# EAGLE board VCFA_v3 (EAGLE 9.4.2)
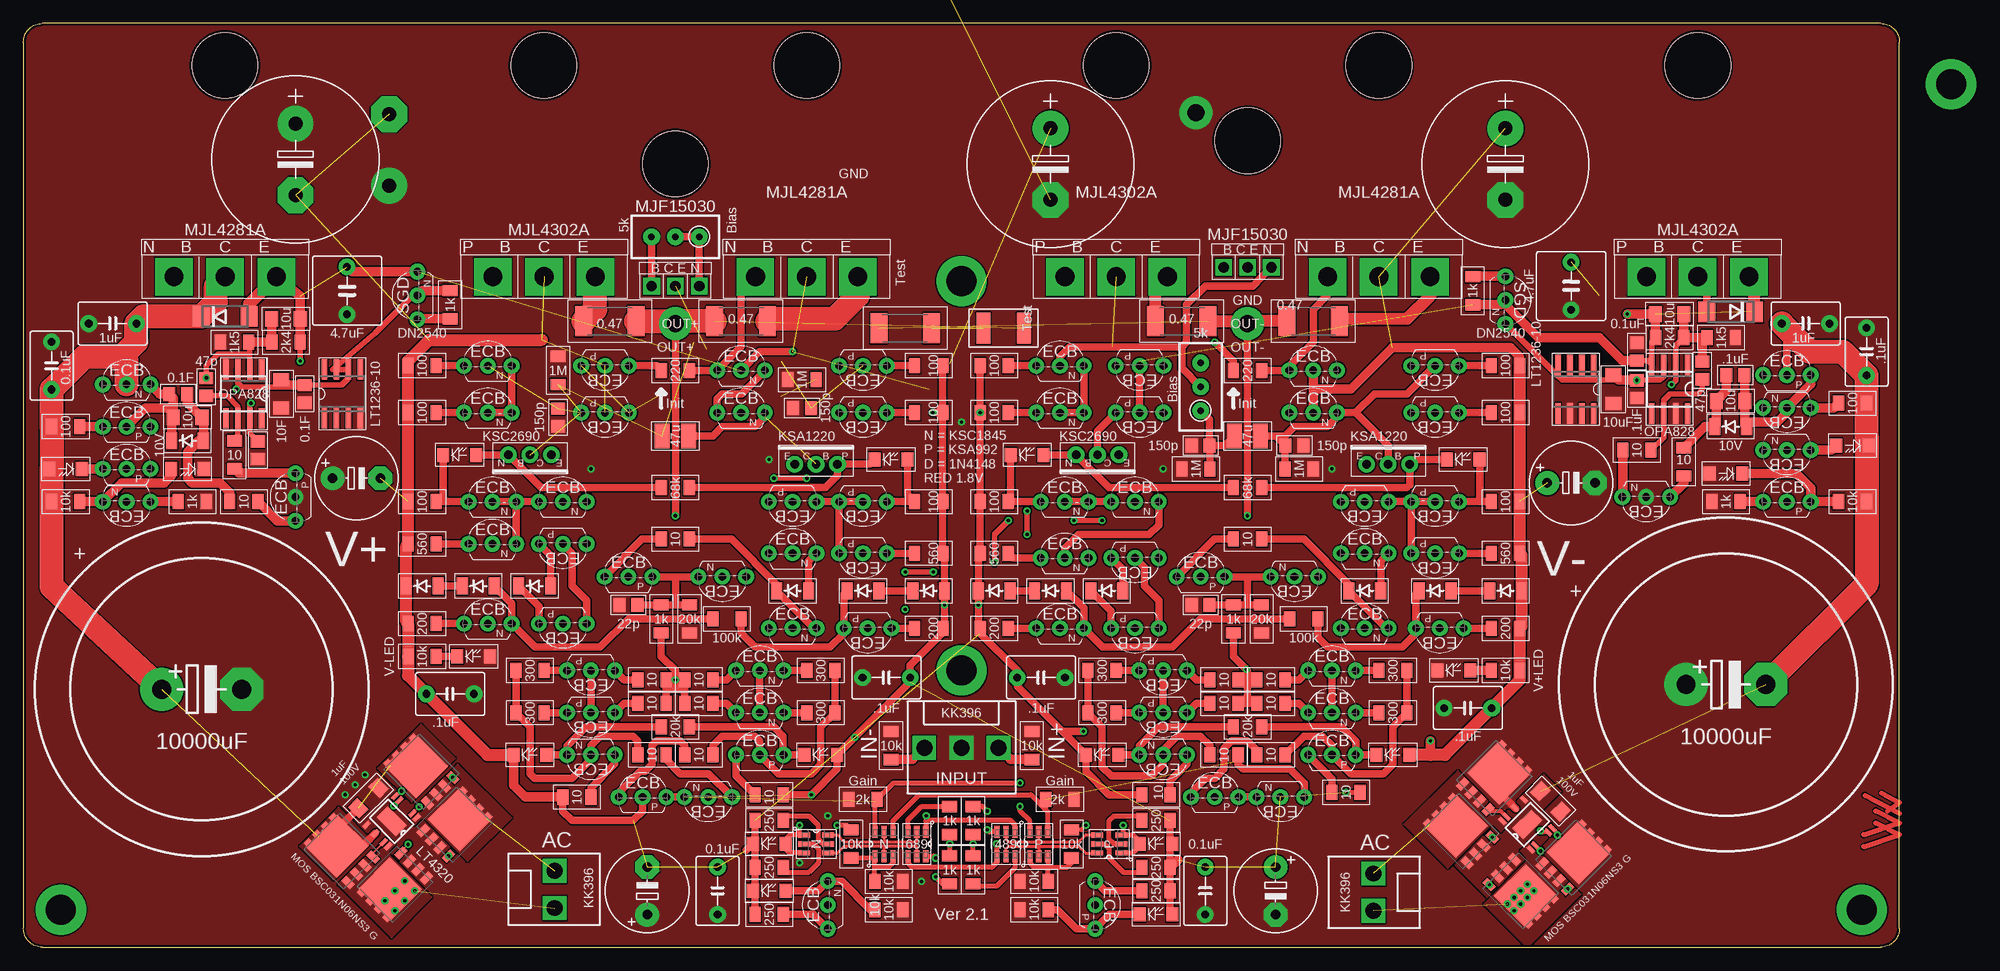
[diagram p4: board, top side]
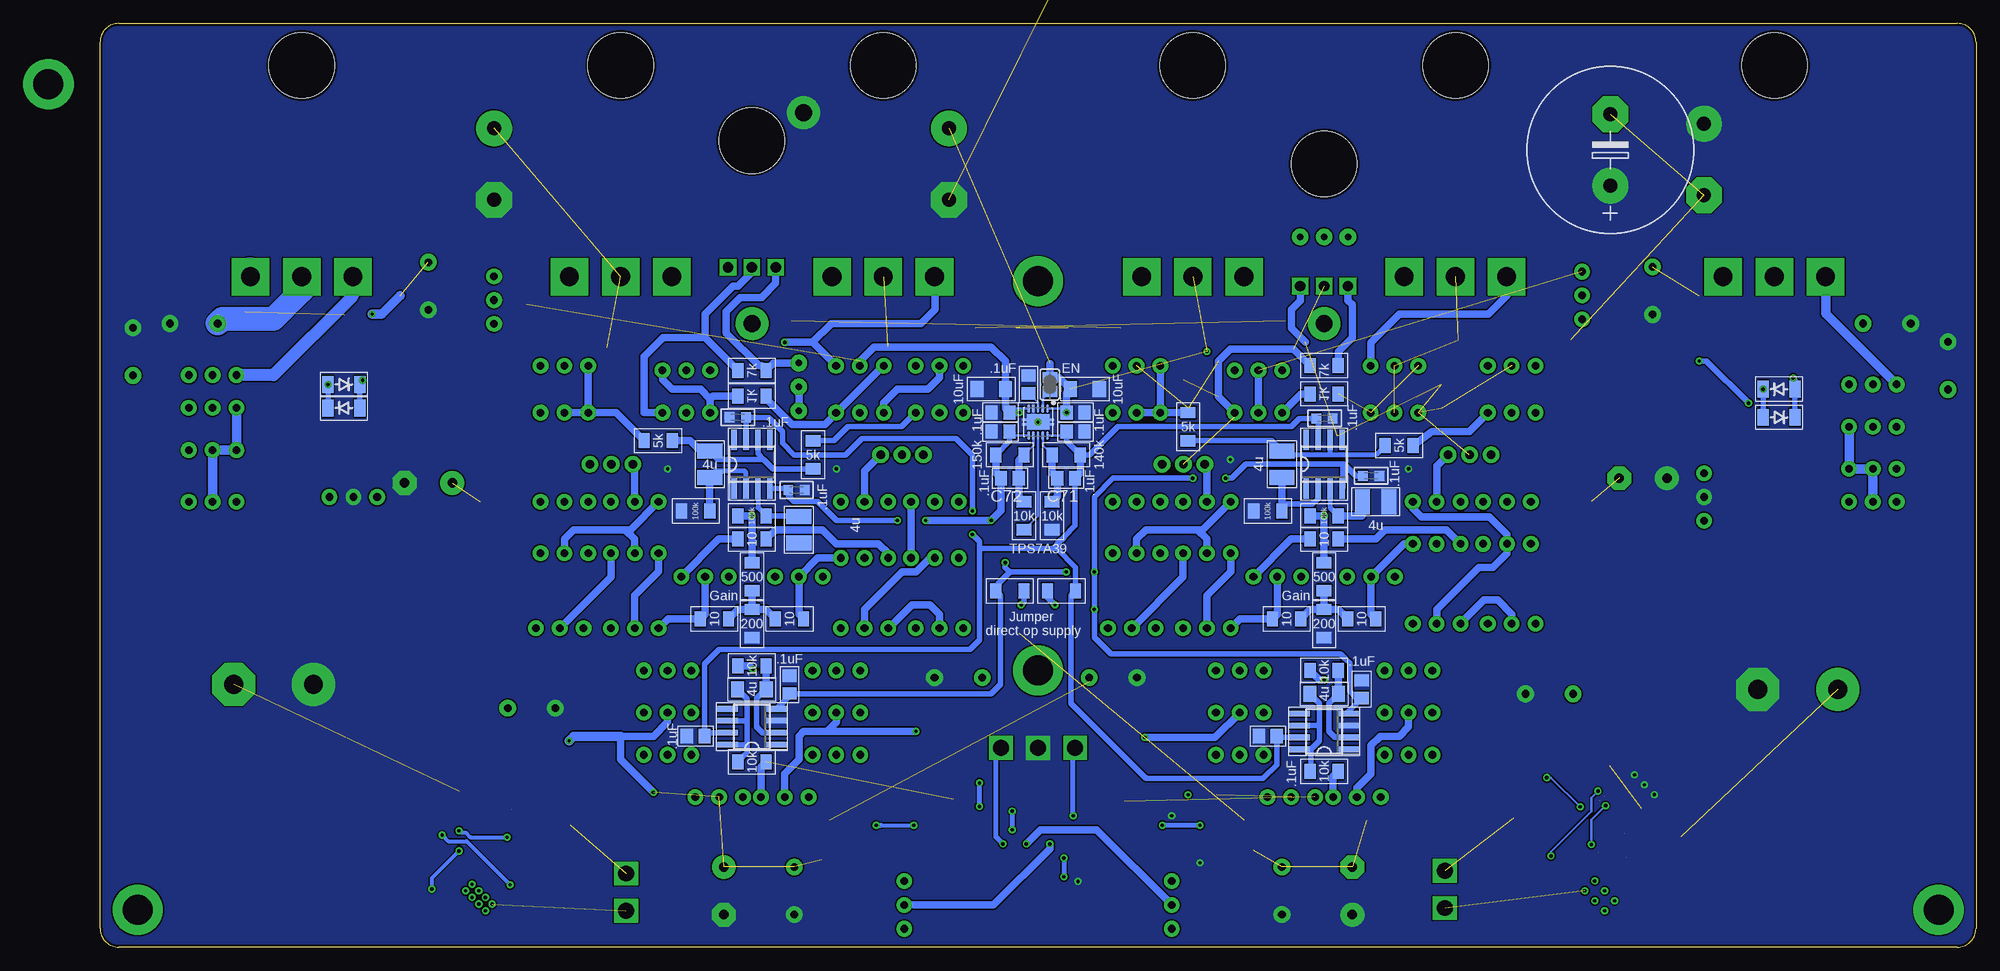
[diagram p5: board, bottom side, seen from below]

Size 200 x 98.5 mm. Coordinates in mm from the lower left corner, seen from the top.
Outline: 2,0 198,0 arc90 200,2 200,96.5 arc90 198,98.5 2,98.5 arc90 0,96.5 0,2 arc90 2,0
Copper layers (1*16): Top 0.035mm / dielectric 1.5mm / Bottom 0.035mm
Design rules "default *": minimum track width 6mil, minimum drill 0.35mm, track to track 6mil, track to pad 6mil, pad to pad 6mil, via to via 6mil, smd to smd 0mil, copper to edge 10mil, drill to drill 6mil, minimum pad ring 10mil, minimum via ring 8mil, stop-mask expansion 4mil, vias tented up to drill 0.35mm, thermal gap 3mil
Holes 7 mm at 21.5,94 55.5,94 83.5,94 69.5,83.5 116.5,94 144.5,94 130.5,86 178.5,94

## Footprints (pad centres in the part's own frame; a part is rotated, then mirrored left to right if it is on the bottom)
ECHU-Y = smd 1.5 x 3.3: 1 -2.15,0; 2 2.15,0
C0805 = smd 1.3 x 1.5: 1 -0.95,0; 2 0.95,0
E7,5-18 = drill 1.5 pad 3.81: + -3.81,0 | drill 1.5 pad 3.81 octagon: - 3.81,0
C050-045X075 = drill 0.813 pad 1.778: 1 -2.54,0; 2 2.54,0
C1206 = smd 1.4 x 1.7: 1 -1.527,0; 2 1.527,0
C1210 = smd 1.6 x 2.7: 1 -1.4,0; 2 1.4,0
C0603K = smd 1.05 x 1.08: 1 -0.875,0; 2 0.875,0
E5-8,5 = drill 1.016 pad 2.54: + -2.54,0 | drill 1.016 pad 2.54 octagon: - 2.54,0
EB35D-8.5 = drill 2.007 pad 4.597: + -4.25,0 | drill 2.007 pad 4.597 octagon: - 4.25,0
C050-075X075 = drill 0.813 pad 1.778: 1 -2.54,0; 2 2.54,0
SOD80C = smd 1.2 x 1.8: A 1.7,0; C -1.7,0
DO214AA = smd 1.8 x 2.2: A 2.55,0; C -2.55,0
SO8 = smd 0.6 x 2.2: 1 -1.905,-2.6; 2 -0.635,-2.6; 3 0.635,-2.6; 4 1.905,-2.6; 5 1.905,2.6; 6 0.635,2.6; 7 -0.635,2.6; 8 -1.905,2.6
M3_HOLE = drill 3.2 pad 5.334: P$1 0,0
SOIC8 = smd 0.6 x 2.2: 1 -1.905,-2.6; 2 -0.635,-2.6; 3 0.635,-2.6; 4 1.905,-2.6; 5 1.905,2.6; 6 0.635,2.6; 7 -0.635,2.6; 8 -1.905,2.6
LED_SML1206 = smd 1.3 x 1.5: A 1.75,0; C -1.75,0
PAD-16 = drill 1.8 pad 3.5: P$1 0,0
SOT-23-6 = smd 1.27 x 0.559: 1 -1.295,0.95; 2 -1.295,0; 3 -1.295,-0.95; 4 1.295,-0.95; 5 1.295,0; 6 1.295,0.95
TRANSISTOR_TO92-ECB_P = drill 0.813 pad 1.676: B 2.54,0; C 0,0; E -2.54,0
TRANSISTOR_TO92-ECB_N = drill 0.813 pad 1.676: B 2.54,0; C 0,0; E -2.54,0
TRANSISTOR_TO126_P = drill 0.9 pad 1.778: B 2.286,0; C 0,0; E -2.286,0
TRANSISTOR_TO126_N = drill 0.9 pad 1.778: B 2.286,0; C 0,0; E -2.286,0
TRANSISTOR_TO220_BCE_N = drill 1.1 pad 1.778 square: B -2.54,0; C 0,0; E 2.54,0
TRANSISTOR_TO247_BCE_N = drill 2 pad 4 square: B -5.461,0; C 0,0; E 5.461,0
TRANSISTOR_TO247_BCE_P = drill 2 pad 4 square: B -5.461,0; C 0,0; E 5.461,0
TRANSISTOR_TO92-SGD_N = drill 0.813 pad 1.676: D 2.54,0; G 0,0; S -2.54,0
PG-TDSON-8 = smd 1.3 x 0.75: 1 -2.825,1.905; 2 -2.825,0.635; 3 -2.825,-0.635; 4 -2.825,-1.905; 5 2.825,-1.905; 6 2.825,-0.635; 7 2.825,0.635; 8 2.825,1.905 | smd 4.7 x 4.8: TH 0.725,0
MINI_MELF-0204W = smd 1.2 x 1.6: 1 -1.5,0; 2 1.5,0
RTRIM3296W = drill 0.7 pad 1.778: 1 0,-2.54; 2 0,0; 3 0,2.54
R2512 = smd 1.8 x 3.2: 1 -2.8,0; 2 2.8,0
SJ = smd 1.168 x 1.6: 1 -0.762,0; 2 0.762,0
LT4320_MSOP = smd 0.9 x 0.42: 1 -2.163,1.625; 2 -2.163,0.975; 5 -2.163,-0.975; 6 -2.163,-1.625; 7 2.15,-1.625; 9 2.15,-0.325; 11 2.15,0.975; 12 2.15,1.625 | smd 1.65 x 2.85: EXP 0,0
SON50P300X300X80-11T165X240N = smd 0.86 x 0.27: 1 -1.435,1; 2 -1.435,0.5; 3 -1.435,0; 4 -1.435,-0.5; 5 -1.435,-1; 6 1.435,-1; 7 1.435,-0.5; 8 1.435,0; 9 1.435,0.5; 10 1.435,1 | smd 1.65 x 2.4: 11 0,0 | smd 0.25 x 0.5: 12 0.25,1.45; 13 -0.25,1.435; 14 -0.25,-1.45; 15 0.25,-1.45
KK-156-3 = drill 1.7 pad 2.54 square: 1 -3.96,0; 2 0,0; 3 3.96,0
KK-156-2 = drill 1.7 pad 2.54 square: 1 -1.98,0; 2 1.98,0

## Placement (x,y rotation side)
C1  [ECHU-Y]  104.5,66 180 top
C2  0.1uF  [C0805]  101,60 90 bottom
C3  0.1uF  [C0805]  75.5,22.5 0 bottom
C4  0.1uF  [C0805]  65.5,27.5 90 bottom
C5  1000uF  [E7,5-18]  109.5,83.5 270 top
C6  1000uF  [E7,5-18]  39,85 90 bottom
C7  1000uF  [E7,5-18]  158,83.5 270 top
C8  1000uF  [E7,5-18]  29,84 270 top
C9  0.1uF  [C050-045X075]  92,28.75 180 top
C10  0.1uF  [C050-045X075]  108.5,28.75 180 top
C11  0.1uF  [C050-045X075]  154,25.5 180 top
C12  0.1uF  [C050-045X075]  45.5,27 180 top
C13  10uF  [C1206]  69.5,27 0 bottom
C14  0.1uF  [C0805]  136.5,22.5 0 bottom
C15  0.1uF  [C0805]  126.5,28 90 bottom
C16  10uF  [C1206]  130.5,27.5 0 bottom
C17  22p  [C0805]  64.5,36.5 180 top
C18  47u  [C1210]  69.5,54.5 180 top
C19  150p  [C0805]  83,57.5 0 top
C20  150p  [C0805]  57,56.5 270 top
C21  4.7uF  [C1210]  74,51.5 270 bottom
C22  4.7uF  [C1210]  64,47.5 180 bottom
C23  0.1uF  [C0603K]  69.46,56.39 0 bottom
C24  0.1uF  [C0603K]  64.5,50.25 180 bottom
C25  100uF  [E5-8,5]  133.5,6 270 top
C26  100uF  [E5-8,5]  66.5,6 90 top
C27  22p  [C0805]  125.5,36.5 180 top
C28  47u  [C1210]  130.5,54.5 180 top
C29  150p  [C0805]  135.5,53.5 180 top
C30  150p  [C0805]  125.5,53.5 180 top
C31  4.7uF  [C1210]  135,51.5 270 bottom
C32  4.7uF  [C1210]  125.5,44.5 90 bottom
C33  0.1uF  [C0603K]  132,56.5 180 bottom
C34  0.1uF  [C0603K]  125.75,48.75 180 bottom
C35  100uF  [E5-8,5]  165,49.5 0 top
C36  100uF  [E5-8,5]  35.5,50 0 top
C37  10000uF  [EB35D-8.5]  19,27.5 0 top
C38  10000uF  [EB35D-8.5]  181.5,28 0 top
C39  0.1uF  [C050-045X075]  190,66.5 0 top
C40  10uF  [C1206]  17.5,56.5 0 top
C41  10uF  [C1206]  182,58.25 0 top
C42  0.1uF  [C050-045X075]  9.5,66.5 0 top
C43  0.1uF  [C0805]  16.5,59 0 top
C44  0.1uF  [C0805]  182.5,61 0 top
C45  0.1uF  [C0805]  25,53 90 top
C46  0.1uF  [C0805]  172,63.5 90 top
C47  10uF  [C1206]  27.5,59 270 top
C48  10uF  [C1206]  169.5,59.5 90 top
C49  0.1uF  [C0805]  30,59 270 top
C50  0.1uF  [C0805]  172,59.5 90 top
C51  47p  [C0805]  19.5,59.75 90 top
C52  47p  [C0805]  179,61.5 90 top
C53  10uF  [C1206]  28,67 180 top
C54  10uF  [C1206]  175.5,67.5 180 top
C55  4.7uF  [C050-075X075]  34.5,70 90 top
C56  4.7uF  [C050-075X075]  165,70.5 270 top
C57  47uF  [C1206]  36.77,15.9 45 top
C58  0.1uF  [C050-045X075]  3,62 270 top
C59  47uF  [C1206]  162.8,15.55 135 top
C60  0.1uF  [C050-045X075]  196.5,63.5 90 top
C65  10uF  [C1206]  105,59.5 180 bottom
C66  10uF  [C1206]  95,59.5 0 bottom
C67  0.1uF  [C0805]  104,57 180 bottom
C68  0.1uF  [C0805]  96,57 0 bottom
C69  0.1uF  [C0805]  96,55 0 bottom
C70  0.1uF  [C0805]  104,55 0 bottom
C71  0.1uF  [C0805]  97,50 180 bottom
C72  0.1uF  [C0805]  103,50 180 bottom
C74  0.1uF  [C050-045X075]  126,6 270 top
C75  0.1uF  [C050-045X075]  74,6 90 top
D1  LL4148  [SOD80C]  96.5,38 0 top
D2  LL4148  [SOD80C]  89.5,38 0 top
D3  LL4148  [SOD80C]  48.5,38.5 0 top
D4  LL4148  [SOD80C]  42.5,38.5 0 top
D5  LL4148  [SOD80C]  82,38 0 top
D6  LL4148  [SOD80C]  54.5,38.5 0 top
D7  LL4148  [SOD80C]  158,38 0 top
D8  LL4148  [SOD80C]  150.5,38 0 top
D9  LL4148  [SOD80C]  109.5,38 0 top
D10  LL4148  [SOD80C]  103.5,38 0 top
D11  LL4148  [SOD80C]  143,38 0 top
D12  LL4148  [SOD80C]  115.5,38 0 top
D13  BZT55B10  [SOD80C]  17.5,54 0 top
D14  BZT55B10  [SOD80C]  182,55.5 0 top
D15  S1G  [DO214AA]  21.5,67.25 0 top
D16  S1G  [DO214AA]  182,67.75 180 top
D17  LT1236-10  [SO8]  34,59 0 top
D18  LT1236-10  [SO8]  165.5,59.5 180 top
D19  LL4148  [SOD80C]  21,59.5 0 bottom
D20  LL4148  [SOD80C]  21,56.5 180 bottom
D21  LL4148  [SOD80C]  174,57.5 0 bottom
D22  LL4148  [SOD80C]  174,60 180 bottom
H1  HOLE  [M3_HOLE]  4,4 0 top
H2  HOLE  [M3_HOLE]  196,4 0 top
H3  HOLE  [M3_HOLE]  23.5,110 0 top  (outside the outline)
H4  HOLE  [M3_HOLE]  205.5,92 0 top  (outside the outline)
H5  HOLE  [M3_HOLE]  -16,44.5 0 top  (outside the outline)
H6  HOLE  [M3_HOLE]  100,29.5 0 top
H7  HOLE  [M3_HOLE]  228.5,29.5 0 top  (outside the outline)
H8  HOLE  [M3_HOLE]  100,71 0 top
IC1  LTC2057HV  [SOIC8]  69.5,23 90 bottom
IC2  LTC2057HV  [SOIC8]  130.5,23.5 90 bottom
IC3  LTC2057HV  [SOIC8]  69.5,51.5 0 bottom
IC4  LTC2057HV  [SOIC8]  130.5,51.5 0 bottom
IC5  OPA827  [SOIC8]  175.5,59.5 180 top
IC6  OPA827  [SOIC8]  23.5,59 180 top
LED1  RED  [LED_SML1206]  120.75,3.5 0 top
LED2  RED  [LED_SML1206]  79.5,6 0 top
LED3  RED  [LED_SML1206]  120.75,11 0 top
LED4  RED  [LED_SML1206]  79.5,11 0 top
LED5  RED  [LED_SML1206]  85,20.5 0 top
LED6  RED  [LED_SML1206]  54,20.5 0 top
LED7  RED  [LED_SML1206]  146,20.5 0 top
LED8  RED  [LED_SML1206]  115,20.5 0 top
LED9  RED  [LED_SML1206]  92.5,52 0 top
LED10  RED  [LED_SML1206]  46.5,52.5 0 top
LED11  RED  [LED_SML1206]  153.5,52 0 top
LED12  RED  [LED_SML1206]  107,52.5 0 top
LED13  RED  [LED_SML1206]  17.5,51 180 top
LED14  RED  [LED_SML1206]  181.5,50.5 180 top
LED15  RED  [LED_SML1206]  4.5,51 180 top
LED16  RED  [LED_SML1206]  195,53.5 180 top
LED17  RED  [LED_SML1206]  152.5,29.5 0 top
LED18  RED  [LED_SML1206]  48,31 0 top
PAD1  PAD  [PAD-16]  69.5,66.5 0 top
PAD2  PAD  [PAD-16]  130.5,66.5 0 top
PAD3  PAD  [PAD-16]  125,89 0 top
PAD4  PAD  [PAD-16]  94,111 0 top  (outside the outline)
Q1  LSK689  [SOT-23-6]  95.25,11 270 top
Q2  KSA992  [TRANSISTOR_TO92-ECB_P]  114.25,4.5 270 top
Q3  KSC1845  [TRANSISTOR_TO92-ECB_N]  85.75,4.5 90 top
Q4  LSK489  [SOT-23-6]  104.75,11 270 top
Q5  LS3550  [SOT-23-6]  108.25,11 90 top
Q6  LS3250  [SOT-23-6]  91.75,11 90 top
Q7  LS3250  [SOT-23-6]  84.5,11 0 top
Q8  LS3550  [SOT-23-6]  115.75,11 180 top
Q9  KSC1845  [TRANSISTOR_TO92-ECB_N]  73,16 180 top
Q10  KSA992  [TRANSISTOR_TO92-ECB_P]  66,16 0 top
Q11  KSA992  [TRANSISTOR_TO92-ECB_P]  78.5,20.5 0 top
Q12  KSC1845  [TRANSISTOR_TO92-ECB_N]  60.5,20.5 180 top
Q13  KSC1845  [TRANSISTOR_TO92-ECB_N]  78.5,29.5 0 top
Q14  KSA992  [TRANSISTOR_TO92-ECB_P]  60.5,29.5 180 top
Q15  KSC1845  [TRANSISTOR_TO92-ECB_N]  78.5,25 0 top
Q16  KSA992  [TRANSISTOR_TO92-ECB_P]  60.5,25 180 top
Q17  KSC1845  [TRANSISTOR_TO92-ECB_N]  134,16 180 top
Q18  KSA992  [TRANSISTOR_TO92-ECB_P]  127,16 0 top
Q19  KSA992  [TRANSISTOR_TO92-ECB_P]  139.5,20.5 0 top
Q20  KSC1845  [TRANSISTOR_TO92-ECB_N]  121.5,20.5 180 top
Q21  KSC1845  [TRANSISTOR_TO92-ECB_N]  139.5,29.5 0 top
Q22  KSA992  [TRANSISTOR_TO92-ECB_P]  121.5,29.5 180 top
Q23  KSC1845  [TRANSISTOR_TO92-ECB_N]  139.5,25 0 top
Q24  KSA992  [TRANSISTOR_TO92-ECB_P]  121.5,25 180 top
Q25  KSA992  [TRANSISTOR_TO92-ECB_P]  90,34 180 top
Q26  KSA992  [TRANSISTOR_TO92-ECB_P]  64.5,39.5 0 top
Q27  KSC1845  [TRANSISTOR_TO92-ECB_N]  74.5,39.5 180 top
Q28  KSC1845  [TRANSISTOR_TO92-ECB_N]  49.5,34.5 0 top
Q29  KSC1845  [TRANSISTOR_TO92-ECB_N]  82,42 0 top
Q30  KSC1845  [TRANSISTOR_TO92-ECB_N]  82,34 0 top
Q31  KSA992  [TRANSISTOR_TO92-ECB_P]  57.5,43 180 top
Q32  KSA992  [TRANSISTOR_TO92-ECB_P]  57.5,34.5 180 top
Q33  KSA992  [TRANSISTOR_TO92-ECB_P]  89.5,42 180 top
Q34  KSC1845  [TRANSISTOR_TO92-ECB_N]  50,43 0 top
Q35  KSA992  [TRANSISTOR_TO92-ECB_P]  89.5,47.5 180 top
Q36  KSA992  [TRANSISTOR_TO92-ECB_P]  82,47.5 180 top
Q37  KSC1845  [TRANSISTOR_TO92-ECB_N]  57.5,47.5 0 top
Q38  KSC1845  [TRANSISTOR_TO92-ECB_N]  50,47.5 0 top
Q39  KSA1220  [TRANSISTOR_TO126_P]  84.5,51.5 0 top
Q40  KSC2690  [TRANSISTOR_TO126_N]  54,52.5 180 top
Q41  KSA992  [TRANSISTOR_TO92-ECB_P]  89.5,57 180 top
Q42  KSC1845  [TRANSISTOR_TO92-ECB_N]  49.5,57 0 top
Q43  KSA992  [TRANSISTOR_TO92-ECB_P]  89.5,62 180 top
Q44  KSC1845  [TRANSISTOR_TO92-ECB_N]  49.5,62 0 top
Q45  MJE15030  [TRANSISTOR_TO220_BCE_N]  69.5,70.5 0 top
Q46  KSC1845  [TRANSISTOR_TO92-ECB_N]  76.5,57 0 top
Q47  KSA992  [TRANSISTOR_TO92-ECB_P]  62,57 180 top
Q48  KSC1845  [TRANSISTOR_TO92-ECB_N]  76.5,61.5 0 top
Q49  KSA992  [TRANSISTOR_TO92-ECB_P]  62,62 180 top
Q50  MJL4281A  [TRANSISTOR_TO247_BCE_N]  83.5,71.5 0 top
Q51  MJL4302A  [TRANSISTOR_TO247_BCE_P]  55.5,71.5 0 top
Q52  KSA992  [TRANSISTOR_TO92-ECB_P]  151,34 180 top
Q53  KSA992  [TRANSISTOR_TO92-ECB_P]  125.5,39.5 0 top
Q54  KSC1845  [TRANSISTOR_TO92-ECB_N]  135.5,39.5 180 top
Q55  KSC1845  [TRANSISTOR_TO92-ECB_N]  110.5,34 0 top
Q56  KSC1845  [TRANSISTOR_TO92-ECB_N]  143,42 0 top
Q57  KSC1845  [TRANSISTOR_TO92-ECB_N]  143,34 0 top
Q58  KSA992  [TRANSISTOR_TO92-ECB_P]  118.5,41.5 180 top
Q59  KSA992  [TRANSISTOR_TO92-ECB_P]  118.5,34 180 top
Q60  KSA992  [TRANSISTOR_TO92-ECB_P]  150.5,42 180 top
Q61  KSC1845  [TRANSISTOR_TO92-ECB_N]  111,41.5 0 top
Q62  KSA992  [TRANSISTOR_TO92-ECB_P]  150.5,47.5 180 top
Q63  KSA992  [TRANSISTOR_TO92-ECB_P]  143,47.5 180 top
Q64  KSC1845  [TRANSISTOR_TO92-ECB_N]  118.5,47.5 0 top
Q65  KSC1845  [TRANSISTOR_TO92-ECB_N]  111,47.5 0 top
Q66  KSA1220  [TRANSISTOR_TO126_P]  145.5,51.5 0 top
Q67  KSC2690  [TRANSISTOR_TO126_N]  114.5,52.5 180 top
Q68  KSA992  [TRANSISTOR_TO92-ECB_P]  150.5,57 180 top
Q69  KSC1845  [TRANSISTOR_TO92-ECB_N]  110.5,57 0 top
Q70  KSA992  [TRANSISTOR_TO92-ECB_P]  150.5,62 180 top
Q71  KSC1845  [TRANSISTOR_TO92-ECB_N]  110.5,62 0 top
Q72  MJE15030  [TRANSISTOR_TO220_BCE_N]  130.5,72.5 0 top
Q73  KSC1845  [TRANSISTOR_TO92-ECB_N]  137.5,57 0 top
Q74  KSA992  [TRANSISTOR_TO92-ECB_P]  119,57 180 top
Q75  KSC1845  [TRANSISTOR_TO92-ECB_N]  137.5,61.5 0 top
Q76  KSA992  [TRANSISTOR_TO92-ECB_P]  119,62 180 top
Q77  MJL4281A  [TRANSISTOR_TO247_BCE_N]  144.5,71.5 0 top
Q78  MJL4302A  [TRANSISTOR_TO247_BCE_P]  116.5,71.5 0 top
Q79  KSC1845  [TRANSISTOR_TO92-ECB_N]  11,47.5 180 top
Q80  KSA992  [TRANSISTOR_TO92-ECB_P]  188,47.5 0 top
Q81  KSA992  [TRANSISTOR_TO92-ECB_P]  11,51 0 top
Q82  KSC1845  [TRANSISTOR_TO92-ECB_N]  188,53 180 top
Q83  KSA992  [TRANSISTOR_TO92-ECB_P]  11,55.5 0 top
Q84  KSC1845  [TRANSISTOR_TO92-ECB_N]  188,57.5 180 top
Q85  KSA992  [TRANSISTOR_TO92-ECB_P]  29,48 90 top
Q86  KSC1845  [TRANSISTOR_TO92-ECB_N]  173,48 180 top
Q87  KSC1845  [TRANSISTOR_TO92-ECB_N]  11,60 0 top
Q88  KSA992  [TRANSISTOR_TO92-ECB_P]  188,61 0 top
Q89  MJL4281A  [TRANSISTOR_TO247_BCE_N]  21.5,71.5 0 top
Q90  MJL4302A  [TRANSISTOR_TO247_BCE_P]  178.5,71.5 0 top
Q91  DN2540  [TRANSISTOR_TO92-SGD_N]  42,69.5 90 top
Q92  DN2540  [TRANSISTOR_TO92-SGD_N]  158,69 270 top
Q97  MOS_SMDTDSON-8  [PG-TDSON-8]  42.42,18.73 135 top
Q98  MOS_SMDTDSON-8  [PG-TDSON-8]  33.94,10.24 135 top
Q99  MOS_SMDTDSON-8  [PG-TDSON-8]  39.6,6.71 225 top
Q100  MOS_SMDTDSON-8  [PG-TDSON-8]  45.96,13.07 45 top
Q105  MOS_SMDTDSON-8  [PG-TDSON-8]  165.27,9.54 45 top
Q106  MOS_SMDTDSON-8  [PG-TDSON-8]  156.79,18.03 45 top
Q107  MOS_SMDTDSON-8  [PG-TDSON-8]  153.25,12.37 135 top
Q108  MOS_SMDTDSON-8  [PG-TDSON-8]  159.62,6 315 top
R3  10K  [MINI_MELF-0204W]  107.75,4 0 top
R4  10K  [MINI_MELF-0204W]  92.25,4 0 top
R5  250  [MINI_MELF-0204W]  120.75,6 0 top
R6  1K  [MINI_MELF-0204W]  98.75,13.5 270 top
R7  250  [MINI_MELF-0204W]  79.5,3.5 0 top
R8  1K  [MINI_MELF-0204W]  98.75,8.25 90 top
R9  1K  [MINI_MELF-0204W]  101.25,13.5 90 top
R10  1K  [MINI_MELF-0204W]  101.25,8.25 270 top
R11  2k  [MINI_MELF-0204W]  89.5,15.75 0 top
R12  250  [MINI_MELF-0204W]  120.75,13.5 0 top
R13  250  [MINI_MELF-0204W]  79.5,13.5 0 top
R14  10K  [MINI_MELF-0204W]  111.75,11 90 top
R15  10K  [MINI_MELF-0204W]  107.75,7 0 top
R16  10K  [MINI_MELF-0204W]  92.25,7 0 top
R17  10K  [MINI_MELF-0204W]  88.25,11 270 top
R18  250  [MINI_MELF-0204W]  120.75,8.5 0 top
R19  250  [MINI_MELF-0204W]  79.5,8.5 0 top
R20  2k  [MINI_MELF-0204W]  110.5,15.75 180 top
R21  10K  [MINI_MELF-0204W]  69.5,18.75 0 bottom
R22  20K  [MINI_MELF-0204W]  69.5,23.5 0 top
R23  250  [MINI_MELF-0204W]  79.5,16.25 0 top
R24  10  [MINI_MELF-0204W]  72,20.5 180 top
R25  10  [MINI_MELF-0204W]  67,20.5 180 top
R26  250  [MINI_MELF-0204W]  59,16 0 top
R27  300  [MINI_MELF-0204W]  85,29.5 0 top
R28  300  [MINI_MELF-0204W]  54,29.5 0 top
R29  10K  [MINI_MELF-0204W]  69.5,29.5 0 bottom
R30  10  [MINI_MELF-0204W]  72,28.5 0 top
R31  10  [MINI_MELF-0204W]  67,28.5 0 top
R32  300  [MINI_MELF-0204W]  85,25 0 top
R33  300  [MINI_MELF-0204W]  54,25 0 top
R34  10  [MINI_MELF-0204W]  72,26 0 top
R35  10  [MINI_MELF-0204W]  67,26 0 top
R36  10K  [MINI_MELF-0204W]  130.5,19.75 0 bottom
R37  20K  [MINI_MELF-0204W]  130.5,23.5 0 top
R38  250  [MINI_MELF-0204W]  141,16.5 0 top
R39  10  [MINI_MELF-0204W]  133,20.5 180 top
R40  10  [MINI_MELF-0204W]  128,20.5 180 top
R41  250  [MINI_MELF-0204W]  120.75,16.25 0 top
R42  300  [MINI_MELF-0204W]  146,29.5 0 top
R43  300  [MINI_MELF-0204W]  115,29.5 0 top
R44  10K  [MINI_MELF-0204W]  130.5,30 0 bottom
R45  10  [MINI_MELF-0204W]  133,28.5 0 top
R46  10  [MINI_MELF-0204W]  128,28.5 0 top
R47  300  [MINI_MELF-0204W]  146,25 0 top
R48  300  [MINI_MELF-0204W]  115,25 0 top
R49  10  [MINI_MELF-0204W]  133,26 0 top
R50  10  [MINI_MELF-0204W]  128,26 0 top
R51  1k  [MINI_MELF-0204W]  68,35 270 top
R52  20k  [MINI_MELF-0204W]  71,35 90 top
R53  100k  [MINI_MELF-0204W]  75,35 0 top
R54  200  [MINI_MELF-0204W]  96.5,34 0 top
R55  10  [MINI_MELF-0204W]  69.5,43.5 0 top
R56  10  [MINI_MELF-0204W]  69.5,43.5 180 bottom
R57  200  [MINI_MELF-0204W]  42.5,34.5 0 top
R58  560  [MINI_MELF-0204W]  96.5,42 0 top
R59  10  [MINI_MELF-0204W]  73.5,35 180 bottom
R60  10  [MINI_MELF-0204W]  65.5,35 180 bottom
R61  560  [MINI_MELF-0204W]  42.5,43 0 top
R62  100  [MINI_MELF-0204W]  96.5,47.5 0 top
R63  200  [MINI_MELF-0204W]  69.5,34.5 90 bottom
R64  100  [MINI_MELF-0204W]  42.5,47.5 0 top
R65  68k  [MINI_MELF-0204W]  69.5,49 0 top
R66  500  [MINI_MELF-0204W]  69.5,39.5 90 bottom
R67  100  [MINI_MELF-0204W]  96.5,57 0 top
R68  5k  [MINI_MELF-0204W]  84,55.5 90 bottom
R69  5k  [MINI_MELF-0204W]  61.5,53.5 180 bottom
R70  100  [MINI_MELF-0204W]  42.5,57 0 top
R71  100  [MINI_MELF-0204W]  96.5,62 0 top
R72  100  [MINI_MELF-0204W]  42.5,62 0 top
R73  7k  [MINI_MELF-0204W]  69.5,62 180 bottom
R74  5k  [RTRIM3296W]  69.5,75.75 90 top
R75  1M  [MINI_MELF-0204W]  83,60.5 180 top
R76  1M  [MINI_MELF-0204W]  57,61.5 270 top
R77  1k  [MINI_MELF-0204W]  69.5,59 180 bottom
R78  220  [MINI_MELF-0204W]  69.5,61.5 0 top
R79  100k  [MINI_MELF-0204W]  75.5,46.5 0 bottom
R80  0.5  [R2512]  76.5,66.75 0 top
R81  0.5  [R2512]  62.5,66.75 0 top
R82  100k  [MINI_MELF-0204W]  69.5,46 0 bottom
R83  1k  [MINI_MELF-0204W]  129,35 270 top
R84  20k  [MINI_MELF-0204W]  132,35 90 top
R85  100k  [MINI_MELF-0204W]  136.5,35 0 top
R86  200  [MINI_MELF-0204W]  158,34 0 top
R87  10  [MINI_MELF-0204W]  130.5,43.5 0 top
R88  10  [MINI_MELF-0204W]  130.5,43.5 180 bottom
R89  200  [MINI_MELF-0204W]  103.5,34 0 top
R90  560  [MINI_MELF-0204W]  158,42 0 top
R91  10  [MINI_MELF-0204W]  134.5,35 180 bottom
R92  10  [MINI_MELF-0204W]  126.5,35 180 bottom
R93  560  [MINI_MELF-0204W]  103.5,42 0 top
R94  100  [MINI_MELF-0204W]  158,47.5 0 top
R95  200  [MINI_MELF-0204W]  130.5,34.5 90 bottom
R96  100  [MINI_MELF-0204W]  103.5,47.5 0 top
R97  68k  [MINI_MELF-0204W]  130.5,49 0 top
R98  500  [MINI_MELF-0204W]  130.5,39.5 90 bottom
R99  100  [MINI_MELF-0204W]  158,57 0 top
R100  5k  [MINI_MELF-0204W]  140.5,54 180 bottom
R101  5k  [MINI_MELF-0204W]  124,52.5 270 bottom
R102  100  [MINI_MELF-0204W]  103.5,57 0 top
R103  100  [MINI_MELF-0204W]  158,62 0 top
R104  100  [MINI_MELF-0204W]  103.5,62 0 top
R105  7k  [MINI_MELF-0204W]  130.5,61.5 180 bottom
R106  5k  [RTRIM3296W]  125.5,59.75 0 top
R107  1M  [MINI_MELF-0204W]  136,51 0 top
R108  1M  [MINI_MELF-0204W]  125,51 0 top
R109  1k  [MINI_MELF-0204W]  130.5,58.75 180 bottom
R110  220  [MINI_MELF-0204W]  130.5,61.5 0 top
R111  100k  [MINI_MELF-0204W]  136.5,46.5 0 bottom
R112  0.5  [R2512]  137.5,66.75 0 top
R113  0.5  [R2512]  123.5,66.75 0 top
R114  100k  [MINI_MELF-0204W]  130.5,46 0 bottom
R115  10k  [MINI_MELF-0204W]  4.5,47.5 0 top
R116  10k  [MINI_MELF-0204W]  195,47.5 0 top
R117  1k  [MINI_MELF-0204W]  18,47.5 0 top
R118  1k  [MINI_MELF-0204W]  181.5,47.5 0 top
R119  100  [MINI_MELF-0204W]  4.5,55.5 0 top
R120  10  [MINI_MELF-0204W]  23.5,47.5 0 top
R121  10  [MINI_MELF-0204W]  177,51.75 90 top
R122  100  [MINI_MELF-0204W]  195,58 0 top
R123  10  [MINI_MELF-0204W]  22.5,52.5 270 top
R124  10  [MINI_MELF-0204W]  172,53 180 top
R125  1k  [MINI_MELF-0204W]  45.5,68.5 270 top
R126  1k  [MINI_MELF-0204W]  154.5,70 90 top
R127  1.5k  [MINI_MELF-0204W]  28,64.5 0 top
R128  1.5k  [MINI_MELF-0204W]  22.5,64.5 0 top
R129  1.5k  [MINI_MELF-0204W]  181,65 0 top
R130  1.5k  [MINI_MELF-0204W]  175.5,65 0 top
R131  10k  [MINI_MELF-0204W]  158,29.5 0 top
R132  10k  [MINI_MELF-0204W]  42.5,31 0 top
R133  [R2512]  94,66 180 top
R134  10K  [MINI_MELF-0204W]  107.5,21.5 270 top
R135  10K  [MINI_MELF-0204W]  92.5,21.5 270 top
R136  10k  [MINI_MELF-0204W]  97,52.5 0 bottom
R137  10k  [MINI_MELF-0204W]  98.5,46 90 bottom
R138  10k  [MINI_MELF-0204W]  101.5,46 270 bottom
R139  10k  [MINI_MELF-0204W]  103,52.5 0 bottom
R140  10k  [MINI_MELF-0204W]  103,38 0 bottom
R141  10k  [MINI_MELF-0204W]  97.5,38 180 bottom
S1  VWV  [VWV]  200,13.25 90 top
SJ1  [SJ]  98.75,60 90 bottom
U$2  LT4320MSOP  [LT4320_MSOP]  39.24,13.42 225 top
U$4  LT4320MSOP  [LT4320_MSOP]  160.32,13.08 135 top
U$5  TPS7A39WSON10-7A39  [SON50P300X300X80-11T165X240N]  100,56 270 bottom
X1  KK-156-3  [KK-156-3]  100,21.25 0 top
X2  [KK-156-2]  143.94,5.87 270 top
X3  [KK-156-2]  56.65,6.15 90 top

## Tracks (layer width: path | path; a pad name or v marks a point on that pad's centre or on a via)
+18V  (via drill 0.35)
  Top 0.61: v107,46.5 v107,44
  Bottom 0.254: U$5.10 97.39,54.56 C69.1
  Bottom 0.61: IC4.7 C33.1 128.75,56.5 127.25,55 127.25,53.75 126,52.5 120.5,52.5 118.75,54.25 108.75,54.25 107,52.5 v107,46.5 | IC1.7 74.42,22.36 C3.2 74.55,19.45 76,18 88.5,18 96.5,26 96.5,37.5 R141.1 96,40.5 98,42.5 | C69.1 96.95,53.95 R136.2 94.5,52.5 91.5,55.5 73,55.5 72.11,56.39 C23.1 70.14,56.19 IC3.7 | v107,44 106.25,43.25 106.25,42.5 | IC2.7 135.19,22.86 C14.2 135.55,30.2 134,31.75 107.25,31.75 106.25,32.75 106.25,42.5 | 98,42.5 106.25,42.5 | 98,42.5 98,43 97.56,43.44 97.51,43.44 97.24,43.71 97.24,43.76 96.05,44.95 C71.1
  Bottom 0.813: C71.1 95.5,50.55 R136.2
-18V  (via drill 0.35)
  Top 0.61: v115,45.5 v112,45.5 | v103.5,41 103.5,44 v105,45.5 | v97,40 v94,40 | v83.5,50 v80,50
  Bottom 0.254: U$5.6 102.61,54.56 C70.2
  Bottom 0.61: IC4.4 126.78,48.9 C34.2 126.62,48.12 126,47.5 123.5,47.5 121.5,45.5 v115,45.5 | C24.2 66.12,50.25 67.38,51.5 67.5,51.5 | 67.5,51.5 77.82,51.5 79.32,50 v80,50 | IC1.4 66.9,25.15 C4.1 66.05,26.55 66.75,27.25 66.75,30.3 67.21,30.76 67.26,30.76 67.75,31.25 92.25,31.25 94,33 v94,36 v94,40 94,48 92,50 v83.5,50 | C70.2 103.05,53.95 R139.1 | IC3.4 67.5,48.99 67.5,51.5 | IC2.4 126.5,26.8 C15.1 126.45,27 105,27 104,28 104,37.5 104.25,37.75 | 104.25,37.75 R140.1 | 104.25,37.75 104.25,38.75 103,40 | v97,40 103,40 | 103,40 103.5,40.5 v103.5,41
  Bottom 0.813: R139.1 104.5,50.55 C72.2 103.95,46.55 v105,45.5 v112,45.5
AC1  (1 unrouted)
  pour Top (no thermals): 46.31,19.43 40.83,13.95 41.72,13.07 42.42,13.78 42.78,13.78 47.37,9.18 51.97,13.78
AC2  (via drill 0.35)  (1 unrouted)
  other vias: 40.66,7.06 39.6,6 38.54,4.94 39.6,3.88 40.66,4.94 41.72,6
  pour Top (no thermals): 33.59,6.71 38.71,11.83 39.6,10.95 38.89,10.24 38.89,9.89 43.49,5.29 39.24,1.05
AC3  (via drill 0.35)  (1 unrouted)
  other vias: 158.2,4.59 158.91,5.3 159.62,6 160.32,6.71 161.03,6 160.32,5.3 159.62,4.59 158.91,3.88
  pour Top (no thermals): 165.98,5.65 160.5,11.13 159.62,10.25 160.32,9.54 160.32,9.19 155.73,4.59 160.32,-0.01
AC4  (1 unrouted)
  pour Top (no thermals): 152.9,18.73 158.38,13.25 157.5,12.37 156.79,13.08 156.44,13.08 151.84,8.48 147.24,13.08
BOUT+  (via drill 0.35)
  Top 0.813: R31.2 68.5,27.5 | 68.5,27.5 R35.2 | R30.1 70.5,27.5 | 70.5,27.5 R34.1 | 68.5,27.5 69.5,27.5 | 69.5,27.5 70.5,27.5 | R51.2 68,31 69.5,29.5 v69.5,28.5 69.5,27.5
  Bottom 0.813: R29.1 70,28.5 v69.5,28.5
BOUT-  (via drill 0.35)
  Top 0.813: R46.2 130.5,28.5 | 130.5,28.5 R45.1 | R50.2 130.5,26 | 130.5,26 R49.1 | 130.5,28.5 130.5,26 | R83.2 129,31 v130.38,29.62 130.5,29.5 130.5,28.5
  Bottom 0.813: R44.1 130.75,30 v130.38,29.62
GND  (via drill 0.35)  (1 unrouted)
  Top 0.813: U$4.9 158.2,15.66
  other vias: 139.5,51 121.5,51 60.5,51 95.75,7 36.41,18.37 35.35,17.31 34.29,16.25 100,56 79.5,52 85.75,14 82.75,9
  pour Bottom (isolate 0.125, rank 5, no thermals): 0,104.49 199.94,104.49 199.94,-0.04 0,-0.04
  pour Top (isolate 0.125, rank 5, no thermals): 0,98.99 199.94,98.99 199.94,-0.04 0,-0.04
IN+  (via drill 0.35)
  Top 0.508: Q1.4 94.3,8.95 94.75,8.5 103.25,8.5 103.8,9.05 Q4.4 103.8,10.95 v103.75,11
  Top 1.016: X1.3 105.21,20 R134.2
  Bottom 0.508: v103.75,11 104.5,11.75 104.5,20.71 X1.3
IN-  (via drill 0.35)
  Top 0.508: Q4.1 105.7,13.05 105.25,13.5 96.25,13.5 | Q1.1 96.2,13.45 96.25,13.5 | 96.25,13.5 v96.25,14
  Top 1.016: X1.1 94.79,20 R135.2
  Bottom 0.508: v96.25,14 96.25,21.04 X1.1
N$1
  Bottom 1.016: Q79.C Q81.C Q81.B Q83.B
N$2
  Top 0.508: Q8.2 116.25,11 115.75,11.5 115.75,13.5 116.25,14 118.75,14 R12.1
N$3
  Top 0.813: R54.1 Q25.E
N$4
  Top 0.813: Q10.E 63.46,16.46 65.75,18.75 66.25,18.75 67,19.5 67,21.5 67.5,22 70,22 70.5,21.5 R24.2
N$5
  Top 0.813: R26.2 60.5,17 63.04,19.54 Q12.E
N$6
  Top 0.813: R23.1 75.96,18.29 Q11.E
N$7
  Top 0.813: LED5.C Q11.B 81,20.54 81,22.5 80,23.5 R22.2
N$8
  Top 0.813: R22.1 60,23.5 57.96,21.46 Q12.B LED6.A
N$9
  Top 0.813: R24.1 73.5,21.5 74.5,22.5 78,22.5 78.5,22 Q11.C 80.5,18.5 84,18.5 85,19.5 85,23.5 R32.2 R27.2
N$10
  Top 0.813: R25.2 65.5,22 65,22.5 61.5,22.5 60.5,21.5 Q12.C 60.5,20 58.5,18 54.5,18 54,18.5 54,23.5 R33.1 R28.1
N$11
  Top 0.813: Q9.E 73.04,18.5 70,18.5 68.5,20 R25.1
N$12
  Top 0.813: D5.A 83.7,41.16 Q29.B
  Bottom 0.813: Q25.C 84.54,39.46 Q29.B
N$13
  Top 0.813: R27.1 Q13.B
N$14
  Top 0.813: Q13.E 74.96,28.5 R30.2
N$15
  Top 0.813: R33.2 Q16.B
N$16
  Top 0.813: Q15.B R32.1
N$17
  Top 0.813: Q14.B R28.2
N$18
  Top 0.813: Q14.E 64.04,28.5 R31.1
N$19
  Bottom 0.61: IC1.2 68.36,22.36 69,23 69,25.97 C13.2 68,27.03
  Bottom 0.813: 68,27.03 R29.2
N$20
  Top 0.813: Q15.E 74.96,26 R34.2
N$21
  Top 0.813: Q16.E 64.04,26 R35.1
N$22
  Bottom 0.61: C13.1 70,25.97 70,23.5 | IC1.8 70.91,21.09 | 70.91,21.09 70,22 70,23.5 | IC1.6 70.14,23.64 70,23.5 | R21.1 70.91,18.84 70.91,21.09
N$23
  Top 0.508: Q8.5 115.25,11 115.75,10.5 115.75,9.5 117.25,8 119.25,8 R18.1
N$24
  Bottom 0.254: SJ1.1 99.5,58.49 U$5.2
N$25
  Top 0.813: D1.C D2.A
N$26
  Top 0.813: D2.C 87.46,37.66 Q25.B 87.46,33.46 86,32 78,32 76.5,33.5 R53.2
N$27
  Top 0.813: R55.2 75.5,43.5 80.3,38.7 D5.C 84.3,34 Q30.B
N$28
  Bottom 0.813: Q29.E 79.46,40.04 82,37.5 Q30.C
N$29
  Bottom 0.813: Q27.C 74.5,35.5 R59.2 78.46,35 Q30.E
N$30
  Bottom 0.813: R60.2 68,36 R63.2 | R59.1 71,36 R63.2 | R63.2 R66.1
N$31
  Bottom 0.813: R60.1 64.5,35.5 Q26.C 61,43 Q31.E
N$32
  Top 0.813: D6.A 56.2,41.76 Q31.B
  Bottom 0.813: R56.1 64,43.5 63,44.5 56.46,44.5 Q31.B
N$33
  Top 0.813: D6.C 54.96,36.34 Q32.B
  Bottom 0.813: Q28.C 49.5,35.5 51,37 52.46,37 Q32.B
N$34
  Top 0.813: R57.2 Q28.E
N$35
  Top 0.813: D3.C D4.A
N$36
  Top 0.813: Q31.C 58.5,42 58.5,38.5 60.04,36.96 Q32.E
N$37
  Top 0.813: Q26.E 65.96,43.5 R55.1
N$38
  Bottom 0.813: R56.2 73.04,43.5 Q27.E
N$39
  Top 0.813: 69.5,36.5 R51.1 C17.1 | 69.5,36.5 R52.2 | Q27.B 69.5,39.5 | 69.5,39.5 Q26.B | 69.5,39.5 69.5,36.5
N$40
  Bottom 0.813: Q33.C 89.5,43.5 88.5,44.5 83,44.5 | 83,44.5 82,43.5 Q29.C | Q36.B 82.46,44.5 83,44.5
N$41
  Top 0.813: Q33.B Q35.B | Q35.C Q35.B | Q36.E Q35.B
N$42
  Top 0.813: R58.1 Q33.E
N$43
  Top 0.813: Q20.E 124.04,19.54 122.25,17.75 R41.2
N$44
  Top 0.813: Q19.E 139.5,17.96 R38.1
N$45
  Top 0.813: R37.2 140.5,23.5 142.04,21.96 Q19.B LED7.C
N$46
  Top 0.813: LED8.A Q20.B 118.96,21.46 121,23.5 R37.1
N$47
  Top 0.813: R39.1 136.5,22.5 138.5,22.5 139.5,21.5 Q19.C 141.5,18.5 145,18.5 146,19.5 146,23.5 R47.2 R42.2
N$48
  Top 0.813: R43.1 R48.1 115,23.5 115,19.25 116,18.25 120.25,18.25 121.5,19.5 Q20.C 121.5,21 123,22.5 125.5,22.5 126.5,21.5 R40.2
N$49
  Top 0.813: R39.2 131.5,21 130.5,22 128.81,22 128,21.19 128,19 127,18 126,18 124.46,16.46 Q18.E
N$50
  Top 0.813: Q17.E 136.54,17.46 135,19 130,19 129.5,19.5 R40.1
N$51
  Top 0.813: Q35.E R62.1 94.25,48.25 LED9.A
N$52
  Top 0.813: R42.1 Q21.B
N$53
  Top 0.813: R43.2 Q22.B
N$54
  Top 0.813: R47.1 Q23.B
N$55
  Top 0.813: Q24.B R48.2
N$56
  Top 0.813: Q21.E 135.96,28.5 R45.2
N$57
  Top 0.813: Q22.E 125.04,28.5 R46.1
N$58
  Top 0.813: Q23.E 135.96,26 R49.2
N$59
  Top 0.813: Q24.E 125.04,26 R50.1
N$60
  Bottom 0.61: IC2.2 129.37,22.86 130,23.5 130,26.53 129,27.53
  Bottom 0.813: R44.2 129,27.53 C16.2
N$61
  Bottom 0.61: R36.1 131,20.75 131,21.5 | C16.1 131,26.47 131,24 | 131,21.5 131,24 | IC2.6 131.13,24.14 131,24 | IC2.8 131.09,21.59 131,21.5
N$62
  Bottom 0.813: Q36.C 82,51.29 Q39.E
N$63
  Top 0.813: LED9.C 90.25,51.5 Q39.B 86.79,50.29 85.5,49 R65.2
N$64
  Top 0.813: Q34.B Q38.B | Q38.C Q38.B | Q38.B Q37.E
N$65
  Top 0.813: R64.2 44.5,47.5 | 44.5,47.5 Q38.E | LED10.C 44.75,47.75 44.5,47.5
N$66
  Top 0.813: Q34.E R61.2
N$67
  Bottom 0.813: Q32.C 57.5,36 53,40.5 51.5,40.5 50,42 Q34.C 50,44 51.88,45.88 59.14,45.88 60.04,46.79 Q37.B
N$68
  Bottom 0.813: Q40.E 57.5,51.29 Q37.C
N$69
  Top 0.813: R65.1 55.21,49 Q40.B LED10.A
N$70  (5 unrouted)
  Top 0.813: 72.55,54.5 C18.1 73.5,54.5 74.5,55.5 78,55.5 79.04,56.54 Q46.B
  Bottom 0.813: Q46.B 80.75,58.71 80.75,62.5 79.5,63.75 72.75,63.75 R73.2 71,62.5
N$71
  Bottom 0.813: Q41.C Q41.B | Q41.B Q43.B | Q41.B R68.2
N$72
  Top 0.813: Q42.C Q42.B Q44.B
  Bottom 0.813: R69.1 58,55 54,55 52.04,56.96 Q42.B
N$73
  Top 0.813: R67.1 Q41.E
N$74
  Top 0.813: R71.1 Q43.E
N$75
  Top 1.016: LED15.C Q81.E
N$76
  Top 0.813: R70.2 Q42.E
N$77
  Top 0.813: R72.2 Q44.E
N$78
  Top 0.813: Q48.B 76.54,59 74.5,59 73.96,58.46 Q46.E
  Bottom 0.813: R77.2 71.96,59 Q46.E
N$79  (2 unrouted)
N$80  (6 unrouted)
  Top 0.813: Q45.E R74.1 R74.2
  Bottom 0.813: Q45.E 72.04,68.96 73,68 73,66 71.5,64.5
N$81
  Top 0.813: R78.2 Q48.E 76.5,64.04 76.5,69.96 Q50.B
N$82
  Top 0.813: Q49.E 67.5,62 R78.1
  Bottom 0.813: Q49.E 64.54,64.46 61.5,67.5 52,67.5 50.04,69.46 Q51.B
N$83
  Top 2.54: R80.2 79.55,67 86.5,67 88.96,69.46 Q50.E
N$84
  Top 2.54: R81.1 60.96,68.01 Q51.E
N$85
  Bottom 0.61: IC3.2 70.14,47.87 70.74,47.26 71.79,47.26 71.8,47.25 74,47.25
  Bottom 0.813: R79.2 74,47.25 C21.2
N$86
  Bottom 0.508: IC3.3 68.86,46.87 R82.2
  Bottom 0.813: R82.2 65.5,46 65.4,46.1 C22.2
N$87
  Top 0.813: D3.A 52.04,36.66 Q28.B 54.54,32 61.5,32 64.5,35 R53.1
N$88
  Top 0.813: R74.3 Q45.B
  Bottom 0.813: Q45.B 66.96,68.96 66.5,68.5 66.5,65 68,63.5 R73.1
N$89
  Bottom 0.508: C21.1 73.6,52.5 68.86,52.5 | IC3.6 68.86,52.5 | R69.2 64,52.5 68.86,52.5
  Bottom 0.61: C21.1 75.1,54 R68.1
N$90
  Top 1.016: R119.2 Q83.E
N$93
  Top 0.508: Q7.5 85.25,11 84.75,11.5 84.75,13 83.75,14 81,14 R13.2
N$94
  Top 0.508: Q7.2 84.25,11 84.75,10.5 84.75,9 83.75,8 81,8 R19.2
N$95
  Top 0.305: Q1.5 95.25,10.75 92,10.75 | 92,10.75 91.75,10.5 Q6.2 | 92,10.75 87.5,10.75 86.75,10 85.84,10 Q7.4
N$96
  Top 0.305: Q6.5 91.75,11.5 92,11.25 | 92,11.25 95.25,11.25 Q1.2 | Q7.6 86.8,11.95 87.5,11.25 92,11.25
N$97  (via drill 0.35)
  Top 0.508: Q7.3 81.7,10.05 81.25,10.5 LED4.A 81.25,11.5 81.7,11.95 82.75,11.95 | Q7.1 82.75,11.95 | R17.1 87.75,13 v86.75,13 | 82.75,11.95 v82.75,13
  Bottom 0.508: v82.75,13 v86.75,13
N$98
  Top 0.508: R16.1 90.75,8.5 | 90.75,8.5 90.75,9.65 | 90.75,9.65 Q6.1 | Q6.3 92.7,8.95 92.25,8.5 90.75,8.5 | R17.2 90.59,9.5 90.75,9.65
N$99
  Top 0.813: LED2.A 84.71,6 Q3.B 85.79,7 87.25,7 90.25,4 R4.1
N$100
  Top 1.016: D13.C 15.8,56.33 C40.1 15.97,57.5 | 15.97,57.5 15.97,58.58 C43.1 14.54,59 Q87.B | Q83.C 13,57.5 15.97,57.5
N$101
  Top 0.508: Q5.1 107.3,8.95 107.75,8.5 109.25,8.5 | 109.25,8.5 111.25,8.5 111.75,9 R14.1 | Q5.3 109.2,8.55 109.25,8.5 | R15.2 109.25,8.5
N$102
  Top 0.305: Q4.2 104.75,11.5 105,11.25 108,11.25 | 108,11.25 108.25,11.5 Q5.5 | 108,11.25 112.5,11.25 113.25,12 114.41,12 Q8.4
N$103  (via drill 0.35)
  Top 0.406: v113.25,13 112.75,12.5 R14.2
  Top 0.508: Q8.1 118.3,10.05 119,10.75 LED3.C 119,11.25 118.3,11.95 Q8.3 117.25,12.15 v117.25,13
  Bottom 0.406: 116.75,13 v113.25,13
  Bottom 0.508: v117.25,13 116.75,13
N$104
  Top 0.305: Q4.5 104.75,10.5 105,10.75 108,10.75 | 108,10.75 108.25,10.5 Q5.2 | 108,10.75 112.5,10.75 113.25,10 114.41,10 Q8.6
N$105
  Top 1.016: C43.2 17.45,58.08 C40.2 19.2,56.33 D13.A 18.7,54 17.5,52.8 17.5,50 18,49.5 21,49.5 22,48.5 R120.1
N$106
  Top 1.016: R120.2 27.04,45.46 Q85.E
N$107
  Top 1.016: R117.1 Q79.E
N$108
  Top 0.813: LED1.C 115.79,3.5 Q2.B 112.29,1.96 110.25,4 R3.2
N$109
  Top 0.813: Q2.E 115.29,6 R5.1
N$110  (via drill 0.35)
  Top 0.508: R6.2 v98.75,11 R8.2
  Bottom 0.813: Q2.C 104.75,4.5 98.75,10.5 v98.75,11
N$111  (via drill 0.35)
  Top 0.305: 98,6.75 R8.1
  Top 0.508: Q1.6 97.05,9.71 v97.25,9.5 | v97.25,7.5 98,6.75
  Bottom 0.508: v97.25,9.5 v97.25,7.5
N$112
  Top 0.508: Q1.3 94.3,13.55 95.75,15 R6.1
N$113
  Top 1.016: LED13.A 15.75,50.25 15,49.5 10.46,49.5 Q79.B R115.2
N$114
  Top 1.016: Q80.E R118.2
N$115  (via drill 0.35)
  Top 0.508: Q4.3 102.95,12.29 v102.75,12.5 | v102.75,14.5 102.25,15 R9.2
  Bottom 0.508: v102.75,12.5 v102.75,14.5
N$116
  Top 0.305: 101.5,6.5 R10.2
  Top 0.508: Q4.6 105.7,8.45 103.75,6.5 101.5,6.5
N$117  (via drill 0.35)
  Top 0.508: R10.1 v101.25,11 R9.1
  Bottom 0.813: Q3.C 93.75,12.5 99.75,12.5 v101.25,11
N$118
  Top 0.813: Q3.E 84.25,3.46 84.25,3.5 R7.2
N$119
  Top 1.016: LED14.C 189,50.5 190.54,48.96 Q80.B R116.1
N$120
  Top 1.016: Q86.E 177,49.46 R121.1
N$121
  Top 1.016: R121.2 179.25,55.5 D14.C 180.47,55.67 C41.1 181.55,59.33 C44.1
N$122
  Top 1.016: C44.2 183.53,60.92 C41.2 183.53,55.67 D14.A 184.2,56 187,56 188,57 Q84.C 190.54,60.04 Q88.B
N$123
  Bottom 1.016: Q80.C Q82.C Q82.B Q84.B
N$124
  Top 1.016: R122.1 193,57.5 Q84.E
N$125
  Top 1.016: LED16.A 192.75,53 Q82.E
N$126
  Bottom 1.27: Q90.B 173.04,69.5 181.54,61 Q88.E
N$127
  Bottom 1.016: Q87.E 16.04,67.58 Q89.B
N$128
  Top 0.61: R123.1 22.86,54.37 IC6.6 22.86,57.63 21.7,58.8 C51.1
N$129
  Top 0.61: R124.1 174.87,54.37 IC5.6 174.87,58.37 175.5,59 178.5,59 179,59.5 C52.1
N$130
  Top 1.016: R124.2 170.5,48.04 Q86.B
N$131
  Top 1.016: Q85.B 22.96,50.54 R123.2
N$132  (via drill 0.35)
  Top 0.61: C51.2 19.5,62 20.74,63.24 24.13,63.24 24.14,63.25 | IC6.2 24.14,63.25 | 24.14,63.25 24.14,64.36 R128.2
  Top 1.016: R128.2 R127.1 26.47,64.53 C53.2
  Bottom 0.61: D20.C D19.A 19.3,60.5 C51.2
  other vias: 19.5,60.7
N$133  (via drill 0.35)
  Top 0.61: IC6.3 22.86,60.13 23.25,59.75 | 23.25,59.75 27.88,59.75 28.08,59.95 | C49.1 33.95,59.95 34.63,60.63 D17.6 32.94,61.6 37.5,65.5 41.5,69.5 Q91.G | D19.C 22.95,59.75 23.25,59.75
  Top 1.016: C47.1 28.08,59.95 C49.1 | Q91.G 42.5,70 R125.1
  Bottom 0.61: D19.C D20.A
  other vias: 22.7,59.5
N$134
  Top 1.016: Q91.S 42.04,67 R125.2
N$135  (via drill 0.35)
  Top 0.61: IC5.3 174.87,60.87 174.45,60.45 C50.2 | D18.4 163.59,60.91 | 170.08,60.45 164.05,60.45 163.59,60.91 | Q92.D 158.04,66.46 163.59,60.91
  Top 1.016: C48.2 170.08,60.45 C50.2
  Bottom 0.61: D21.A D22.C 172,60.3 C50.2
  other vias: 172,60.45
N$136
  Top 0.61: 154.54,71.54 R126.2
  Top 1.016: Q92.S 154.54,71.54
N$137  (via drill 0.35)
  Top 0.61: R130.2 176.13,64.14 IC5.2 176.13,60.44 D22.A
  Top 1.016: C54.1 177,67.47 R130.2 R129.1 179,64.5 C52.2
  Bottom 0.61: D22.A D21.C
  other vias: 175.7,60
N$138
  Top 0.813: R132.2 LED18.C
N$139
  Top 1.016: LED17.A R131.1
N$140  (1 unrouted)
N$142
  Bottom 0.254: U$5.7 100.5,53.5 R139.2
  Bottom 0.813: R138.1 102.05,48.05 C72.1 102.05,51.95 R139.2
N$145
  Bottom 0.254: R138.2 100,46 U$5.8
N$146
  Bottom 0.254: U$5.9 99.5,53.5 R136.1
  Bottom 0.813: R136.1 98.5,50.55 C71.2 97.95,48.05 R137.2
N$148
  Bottom 0.254: U$5.3 100,58.05 C2.1
N$157  (1 unrouted)
  Top 0.254: U$2.11 38.41,11.18 37.28,10.05 Q98.4
N$159
  Top 0.813: R86.1 Q52.E
N$160
  Top 0.813: D11.A 144.7,41.16 Q56.B
  Bottom 0.813: Q52.C 145.54,39.46 Q56.B
N$161
  Top 0.813: D7.C D8.A
N$162
  Top 0.813: D8.C 148.46,37.66 Q52.B 148.46,33.46 147,32 139,32 138,33 R85.2
N$163
  Top 0.813: R87.2 136.5,43.5 141.3,38.7 D11.C 145.3,34 Q57.B
N$164
  Bottom 0.813: Q56.E 140.46,40.04 143,37.5 Q57.C
N$165
  Bottom 0.813: Q54.C 135.5,35.5 R91.2 139.46,35 Q57.E
N$166
  Bottom 0.813: R92.2 129,36 R95.2 | R91.1 132,36 R95.2 | R95.2 R98.1
N$167
  Bottom 0.813: R92.1 125.5,35.5 Q53.C 123.5,41.5 Q58.E
N$168
  Top 0.813: D12.A 117.2,40.26 Q58.B
  Bottom 0.813: R88.1 128,44.5 123,44.5 121.5,43 117,43 115.96,41.96 Q58.B
N$169
  Top 0.813: D12.C 115.96,35.84 Q59.B
  Bottom 0.813: Q55.C 110.5,35.5 111.5,36.5 113.46,36.5 Q59.B
N$170
  Top 0.813: Q55.E R89.2
N$171
  Top 0.813: D9.C D10.A
N$172
  Top 0.813: Q58.C 119.5,40.5 119.5,38.5 121.04,36.96 Q59.E
N$173
  Top 0.813: Q53.E 126.96,43.5 R87.1
N$174
  Bottom 0.813: R88.2 134.04,43.5 Q54.E
N$175
  Top 0.813: 130.5,36.5 R83.1 C27.1 | 130.5,36.5 R84.2 | Q54.B 130.5,39.5 | 130.5,39.5 Q53.B | 130.5,39.5 130.5,36.5
N$176
  Bottom 0.813: Q60.C 150.5,43.5 149.5,44.5 144,44.5 | 144,44.5 143,43.5 Q56.C | Q63.B 143.46,44.5 144,44.5
N$177
  Top 0.813: Q60.B Q62.B | Q62.C Q62.B | Q63.E Q62.B
N$178
  Top 0.813: R90.1 Q60.E
N$179
  Top 0.813: Q62.E 155,47.5 | 155,47.5 R94.1 | LED11.A 155.25,47.75 155,47.5
N$180
  Bottom 0.813: Q63.C 143,51.29 Q66.E
N$181
  Top 0.813: R97.2 147.5,49 147.79,49.29 Q66.B 148.29,52 LED11.C
N$182
  Top 0.813: Q65.C Q65.B Q64.E
  Bottom 0.813: Q65.B Q61.B
N$184  (via drill 0.35)  (2 unrouted)
  Top 0.254: U$2.6 40.16,16.64 v40.3,16.64
  Bottom 0.254: v40.3,16.64 41.01,15.93 41.01,14.48 45.31,10.18 Q100.4
  other vias: 45.31,9.72
N$188  (via drill 0.35)  (1 unrouted)
  Top 0.254: U$2.2 42.17,14.97 v42.2,14.97
  Bottom 0.254: v42.2,14.97 45.31,18.08 Q97.4
  other vias: 45.77,18.08
N$189  (via drill 0.35)  (2 unrouted)
  Top 0.254: Q99.4 40.25,10.18 v41.01,10.95 | v39.49,15.09 40.05,15.64 U$2.5
  Bottom 0.254: v41.01,10.95 41.01,13.57 v39.49,15.09
N$201  (1 unrouted)
  Top 0.254: 156.21,14.61 Q106.4
  Top 0.406: U$4.11 157.53,14.49 156.33,14.49 156.21,14.61
N$204  (via drill 0.35)  (1 unrouted)
  Top 0.406: U$4.6 163.54,12.16 v163.54,11.95
  Bottom 0.406: v163.54,11.95 162.9,11.31 160.93,11.31 Q108.4
  other vias: 156.27,6.65
N$208  (via drill 0.35)  (2 unrouted)
  Top 0.406: U$4.2 161.74,10.28 v161.74,10.25
  Bottom 0.406: v161.74,10.25 164.62,7.36 Q105.4
  other vias: 164.62,6.2
N$209  (via drill 0.35)  (1 unrouted)
  Top 0.406: U$4.5 161.9,12.24 v161.74,12.39
  Bottom 0.406: v161.74,12.39 161.56,12.22 161.05,12.22 160.54,11.72 Q107.4
  other vias: 156.6,11.72
N$231
  Top 0.813: Q65.E R96.2 105.25,47.75 LED12.C
N$232
  Top 0.813: R93.2 105.5,41.5 Q61.E
N$233
  Top 0.813: Q64.B 121.04,45.04 120,44 112.5,44 111,42.5 Q61.C
  Bottom 0.813: Q59.C 118.5,36 114.5,40 113,40 111.5,41.5 Q61.C
N$234
  Bottom 0.813: Q67.E 118.5,50.79 Q64.C
N$235
  Top 0.813: R97.1 115.71,49 Q67.B LED12.A
N$236
  Top 0.813: R107.1 134.5,53.45 C29.2 133.55,54.5 C28.1 134.5,54.5 135.5,55.5 139,55.5 140.04,56.54 Q73.B 142,57 | Q70.C 147.5,59 144,59 142,57 | Q66.C 145.5,53.5 142,57
  Bottom 0.813: Q73.B 142,57 142,63 140,65 135.5,65 | R105.2 135.5,65 | 135.5,65 135.5,67.5 132.5,70.5 132,70.5 130.5,72 Q72.C
N$237
  Bottom 0.813: R100.2 145,57 Q68.B | Q68.C Q68.B | Q68.B Q70.B
N$238
  Top 0.813: Q69.C Q69.B Q71.B
  Bottom 0.61: Q69.B 114.54,55.5 120.25,55.5 121.75,54 R101.1
N$239
  Top 0.813: R99.1 Q68.E
N$240
  Top 0.813: R103.1 Q70.E
N$242
  Top 0.813: R102.2 Q69.E
N$243
  Top 0.813: R104.2 Q71.E
N$244
  Bottom 0.813: Q73.E 134.96,58.46 | Q75.B 140.04,60.54 139,59.5 136,59.5 134.96,58.46 | 134.96,58.46 134.67,58.75 R109.2
N$245
  Bottom 0.813: Q76.B 121.46,57 | 121.46,57 Q74.E | R109.1 129,58.5 126.25,55.75 122.71,55.75 121.46,57
N$246
  Top 0.813: C30.1 126.5,53.45 R108.2 | C28.2 128.1,53.5 C30.1 | C30.1 126.45,56.26 R106.1 | Q67.C 114.5,55.04 Q74.B | 133,72.46 Q72.E 131.95,71.41 131.95,71.38 131.07,70.5 126,70.5 124,68.5 124,64.5 123.5,64 | R106.2 123.5,61.75 123.5,64 | 123.5,64 111.5,64 110.5,63 Q71.C
  Bottom 0.813: Q71.C 110.5,60.75 111.75,59.5 115,59.5 116.46,58.04 Q74.B | R106.1 R106.2
N$247
  Top 0.813: R110.2 Q75.E 134.96,61.96 137.5,64.5 137.5,68 139.04,69.54 Q77.B
N$248  (via drill 0.35)
  Top 0.813: R110.1 129,62.5 v127,64.5
  Bottom 0.813: v127,64.5 124.04,64.5 | Q76.E 124.04,64.5 | 124.04,64.5 122.04,66.5 112.5,66.5 111,68 111,71.46 Q78.B
N$249
  Top 1.27: R112.2 140.55,67 147.5,67 150,69.5 150,71.46 Q77.E
N$250
  Top 1.27: R113.1 120.7,70.24 Q78.E
N$251
  Bottom 0.508: IC4.2 131.13,50.63 131.25,50.75 134.35,50.75 134.8,50.3
  Bottom 0.813: R111.2 C31.2 134.8,50.3
N$252
  Bottom 0.508: IC4.3 129.87,46.87 R114.2
  Bottom 0.61: C32.2 125.6,46 R114.2
N$253
  Top 0.813: D9.A 113.04,36.16 Q55.B 115.04,32 122.5,32 125.5,35 R85.1
N$254
  Bottom 0.813: R106.3 128.21,62.29 R105.1 129.5,62 129.75,62 133.25,65.5 133.25,67.75 131.75,69.25 129.5,69.25 127.96,70.79 Q72.B
N$255
  Bottom 0.508: C31.1 134.8,52.7
  Bottom 0.61: 134.8,52.7 134.1,52 129.25,52 | IC4.6 129.87,52.62 129.25,52 | R101.2 128.25,51 129.25,52
  Bottom 0.813: C31.1 136,52.9 137.1,54 R100.1
OUT+  (via drill 0.35)  (1 unrouted)
  Top 0.813: PAD1.P$1 v69.5,46
  Top 2.54: R81.2 69.25,66.75 PAD1.P$1 69.75,66.75 R80.1
  Bottom 0.813: R66.2 v69.5,46 R82.1
OUT-  (via drill 0.35)  (1 unrouted)
  Top 0.813: v130.5,46 PAD2.P$1
  Top 1.27: R113.2 130.25,66.75 | R112.1 130.75,66.75
  Top 2.54: 130.25,66.75 PAD2.P$1 130.75,66.75
  Bottom 0.813: R98.2 v130.5,46 R114.1
UOUT+  (via drill 0.35)  (1 unrouted)
  Top 0.508: 90.75,12.35 Q6.6 90.8,15.55 R11.2 92.75,17.5 v106.25,17.5 | Q5.6 107.3,13.45 106.25,14.5 v106.25,15
  Top 0.813: Q9.B Q10.B
  Bottom 0.508: v106.25,15 v106.25,17.5
  Bottom 0.813: R21.2 68.54,18.21 Q10.B
UOUT-  (1 unrouted)
  Top 0.508: Q5.4 109.2,14.45 108.83,14.82 | Q6.4 92.7,13.45 95.5,16.25 107.4,16.25 108.83,14.82 | R20.2 109,15 108.83,14.82
  Top 0.813: Q17.B Q18.B
  Bottom 0.813: R36.2 129.54,19.21 Q18.B
UV+  (4 unrouted)
  Top 0.813: U$2.9 35.95,10.59 33.59,10.59 Q98.TH 33.43,12.56 C57.1 | Q97.5 Q97.6 41.91,20.14 Q97.TH 41.01,19.24 Q97.7 Q97.8
  Top 1.016: LED15.A 3,51
  Top 2.54: C37.+ 3,38.42 R115.1 3,51 R119.1 C58.2 6.54,63 10.5,63 | 10.5,63 12.04,64.54 C42.2 12.79,67.25 D15.C 20.5,68.8 20.5,70.5 Q89.C | Q87.C 11,62.5 10.5,63
  pour Top (no thermals): 33.06,7.24 37.12,11.3 33.59,14.84 29.52,10.77
  pour Top (no thermals): 41.36,15.54 45.96,20.14 42.42,23.68 37.83,19.08
UV-  (1 unrouted)
  Top 0.813: Q88.C 188,65.96 | D16.A 179.45,70.55 Q90.C
  Top 1.016: 196.5,54.5 196.5,53.75 LED16.C
  Top 2.54: 188,65.96 C39.1 190.46,63.5 193.96,63.5 C60.1 R122.2 196.5,54.5 R116.2 196.5,38.75 C38.-
  Bottom 2.54: C39.1 186.96,67 181.5,67 178.5,70 Q90.C
  pour Top (rank 2, no thermals): 152.55,8.83 159.97,16.26 163.51,12.72 156.08,5.3
  pour Top (no thermals): 159.97,16.26 162.09,18.38 163.86,16.61 161.74,14.49
V+  (via drill 0.35)  (14 unrouted)
  Top 0.508: 122.38,10.88 LED3.A | v141,16.5 R38.2
  Top 0.61: C45.2 24.14,54.81 IC6.7 24.14,57.88 v24.25,58 | v29.5,62.5 R127.2 | 98.2,39 D1.A
  Top 0.813: Q15.C Q13.C | R71.2 R67.2 | R67.2 R62.2 R58.2 98.2,41.8 98.2,39 | D1.A v98.2,36.5 98.2,34.2 R54.2 98,33.5 94.54,30.04 C9.1 94.54,28.29 v88.62,22.38 LED5.A 86.75,19 v84,16.25 R23.2 | 122.25,10.75 R18.2 R5.2 122.25,3.75 LED1.A | 122.25,10.75 122.38,10.88 | R12.2 122.25,10.75 | Q21.C Q23.C | R67.2 C68.1 | Q48.C 78.5,63.5 v82,63.5
  Top 1.016: R127.2 29.53,64.53 C53.1 29.53,69.43 Q89.E | Q91.D 35,72.04 C55.2 | v150,22 150,20.5 | 123.06,9.31 R18.2 | R103.2 159.5,63 158.54,63.96 145.96,63.96 141.5,59.5 137.5,59.5 | Q73.C 137.5,59.5 | 137.5,59.5 Q75.C
  Top 1.27: D15.A 24.05,68.59 Q89.E | R103.2 R99.2 R94.2 R90.2 159.7,41.8 D7.A 159.7,34.2 R86.2 R131.2 159.5,28.46 C11.1 151.54,20.5 | 151.54,20.5 150,20.5 LED7.A | 151.5,20.46 151.54,20.5
  Bottom 0.254: C68.1 97.39,57.44 U$5.1
  Bottom 0.61: v24.25,58 28.75,62.5 v29.5,62.5 | R141.2 99,37.3 v98.2,36.5
  Bottom 0.813: v141,16.5 144.5,20 144.5,22.5 141,22.5 139.5,24 Q23.C | Q15.C 81.12,22.38 v88.62,22.38 | C68.1 96.95,59.08 C66.1 97.79,60.76 SJ1.2 98.75,62.25 | Q48.C Q46.C
  Bottom 1.016: 144.5,22.5 149.5,22.5 v150,22
  other vias: 96.95,57
V-  (via drill 0.35)  (14 unrouted)
  Top 0.61: C46.1 173.15,62.55 IC5.4 173.59,64.59 R130.1
  Top 0.813: Q16.C Q14.C | Q76.C Q74.C | 101.8,42.5 D10.C v101.8,36.5 101.8,34.2 R89.1 102,33.46 105.96,29.5 C10.2 105.96,27.79 110.75,23 | R104.1 R102.1 R96.1 102,42.7 101.8,42.5 | 40.8,42.8 40.8,42.5 | 40.8,42.5 D4.C | R61.1 41,42.7 40.8,42.5 | R13.1 78,11.25 | 78,11.25 LED4.C 77.06,10.31 | 78,11.25 R19.1 78,6.25 LED2.C 78,5.75 R7.1 | Q10.C 66,14.5 65,13.5 58.5,13.5 57.5,14.5 R26.1 56.19,16 | R41.1 115.75,16.25 113.25,18.75 LED8.C 110.75,23 | Q22.C Q24.C | 101.8,42.5 102,42.3 R93.1 | v113,23 110.75,23
  Top 1.016: R130.1 174,67.47 C54.2 v171,67.5 | C46.1 170.45,62.55 168,65 161.5,65 158,68.5 Q92.G 157.5,68.5 R126.1 | R26.1 53.5,16 52.25,17.25 LED6.C
  Top 1.27: D16.C 184.55,70.91 Q90.E | LED6.C 49.46,20.5 C12.2 41,28.96 R132.1 R57.1 40.8,34.7 D4.C 40.8,42.8 R61.1 R64.1 R70.1 R72.1 41,62.5 43.25,64.75 55.25,64.75
  Bottom 0.254: U$5.5 102.61,57.44 C67.1
  Bottom 0.61: R140.2 101.5,36.8 v101.8,36.5
  Bottom 0.813: 122.5,23 125,23 125.5,22.5 125.5,20 127,18.5 Q18.C | 122.5,23 121.5,24 Q24.C | 122.5,23 v113,23 | Q16.C 60.5,23.5 61.5,22.5 63.5,22.5 64.5,21.5 64.5,18.5 66,17 Q10.C | R102.1 C67.1 103.47,57.42 C65.1 103.47,62.47 105,64 116,64 | Q76.C 119,62.5 117.5,64 116,64 | 116.04,64.04 116,64
  Bottom 1.016: v171,67.5 170,67.5 168,69.5
  Bottom 4: 184,71.54 Q90.E
  other vias: 102,57

## Text on the board
tPlace: GND | MJL4281A | MJL4302A | MJL4281A | MJF15030 | Bias | 5k | MJL4281A | MJL4302A | MJF15030 | MJL4302A | Test | 1k | 4.7uF | GND | 1k | Test | 0.47 | 10u | 10u | 0.47 | 0.47 | 1uF | 4.7uF | DN2540 | 0.47 | OUT+ | 5k | OUT- | DN2540 | 0.1uF | 1uF | 2k4 | 1k5 | .1uF | 1k5 | 2k4 | OUT+ | OUT- | LT1236-10 | .1uF | 47p | 100 | 1M | 220 | 100 | 100 | 220 | 100 | 0.1F | 0.1uF | 1M | Bias | OPA828 | LT1236-10 | Init | 150p | Init | 47p | 10u | 100 | 100 | 100 | 100 | 100 | 100 | 10u | 150p | 10uF | .1uF | 10F | 0.1F | OPA828 | 10V | KSC2690 | 47u | KSA1220 | KSC2690 | 150p | 47u | 150p | KSA1220 | 10V | 10 | 10 | 10 | 1M | 1M | N = KSC1845 / P = KSA992 / D = 1N4148 / RED 1.8V | 68k | 68k | 10k | 1k | 10 | 100 | 100 | 100 | 100 | 1k | 10k | 10 | 10 | 560 | + | V+ | 560 | 560 | 560 | V- | + | 1k | 20k | 1k | 20k | 200 | 22p | 200 | 200 | 22p | 200 | 100k | 100k | V-LED | 10k | 300 | 300 | 300 | 300 | 10k | V+LED | 10 | 10 | 10 | 10 | 10 | 10 | .1uF | .1uF | 10 | 10 | 300 | 300 | KK396 | 300 | 300 | .1uF | 20k | 20k | 10000uF | 10k | 10k | .1uF | 10000uF | 10 | 10 | IN- | IN+ | 10 | 10 | Gain | INPUT | Gain | 1uF / 100V | 1uF / 100V | 10 | 10 | 2k | 2k | 10 | 10 | 250 | 1k | 1k | 250 | AC | N | 10k | N | 689 | 489 | P | 10k | P | 0.1uF | AC | 0.1uF | 250 | 1k | 1k | 250 | LT4320 | 10k | 10k | KK396 | 250 | KK396 | 250 | 10k | 10k | Ver 2.1 | 10k | MOS BSC031N06NS3 G | MOS BSC031N06NS3 G
bPlace: 7k | .1uF | 7k | 10uF | 10uF | 1k | 1k | .1uF | 5k | .1uF | .1uF | .1uF | 5k | 5k | 4u | 140k | 150k | 5k | 4u | .1uF | .1uF | .1uF | .1uF | 100k | 100k | 10k | 10k | 100k | 100k | 4u | 4u | 10 | 10 | TPS7A39 | 500 | 500 | Gain | Gain | 10 | 10 | 10 | 10 | 200 | Jumper / direct op supply | 200 | .1uF | .1uF | 10k | 10k | 4u | 4u | .1uF | 10k | 10k | .1uF
bNames: EN
tStop: B C F A II